# EasyEDA schematic 8Vregulator.json
TITLE: Sheet_1; REV: 1.0; Date: 2024-05-04; Sheet: 1/1; Drawn By: stevemuhilane; Company: Your Company
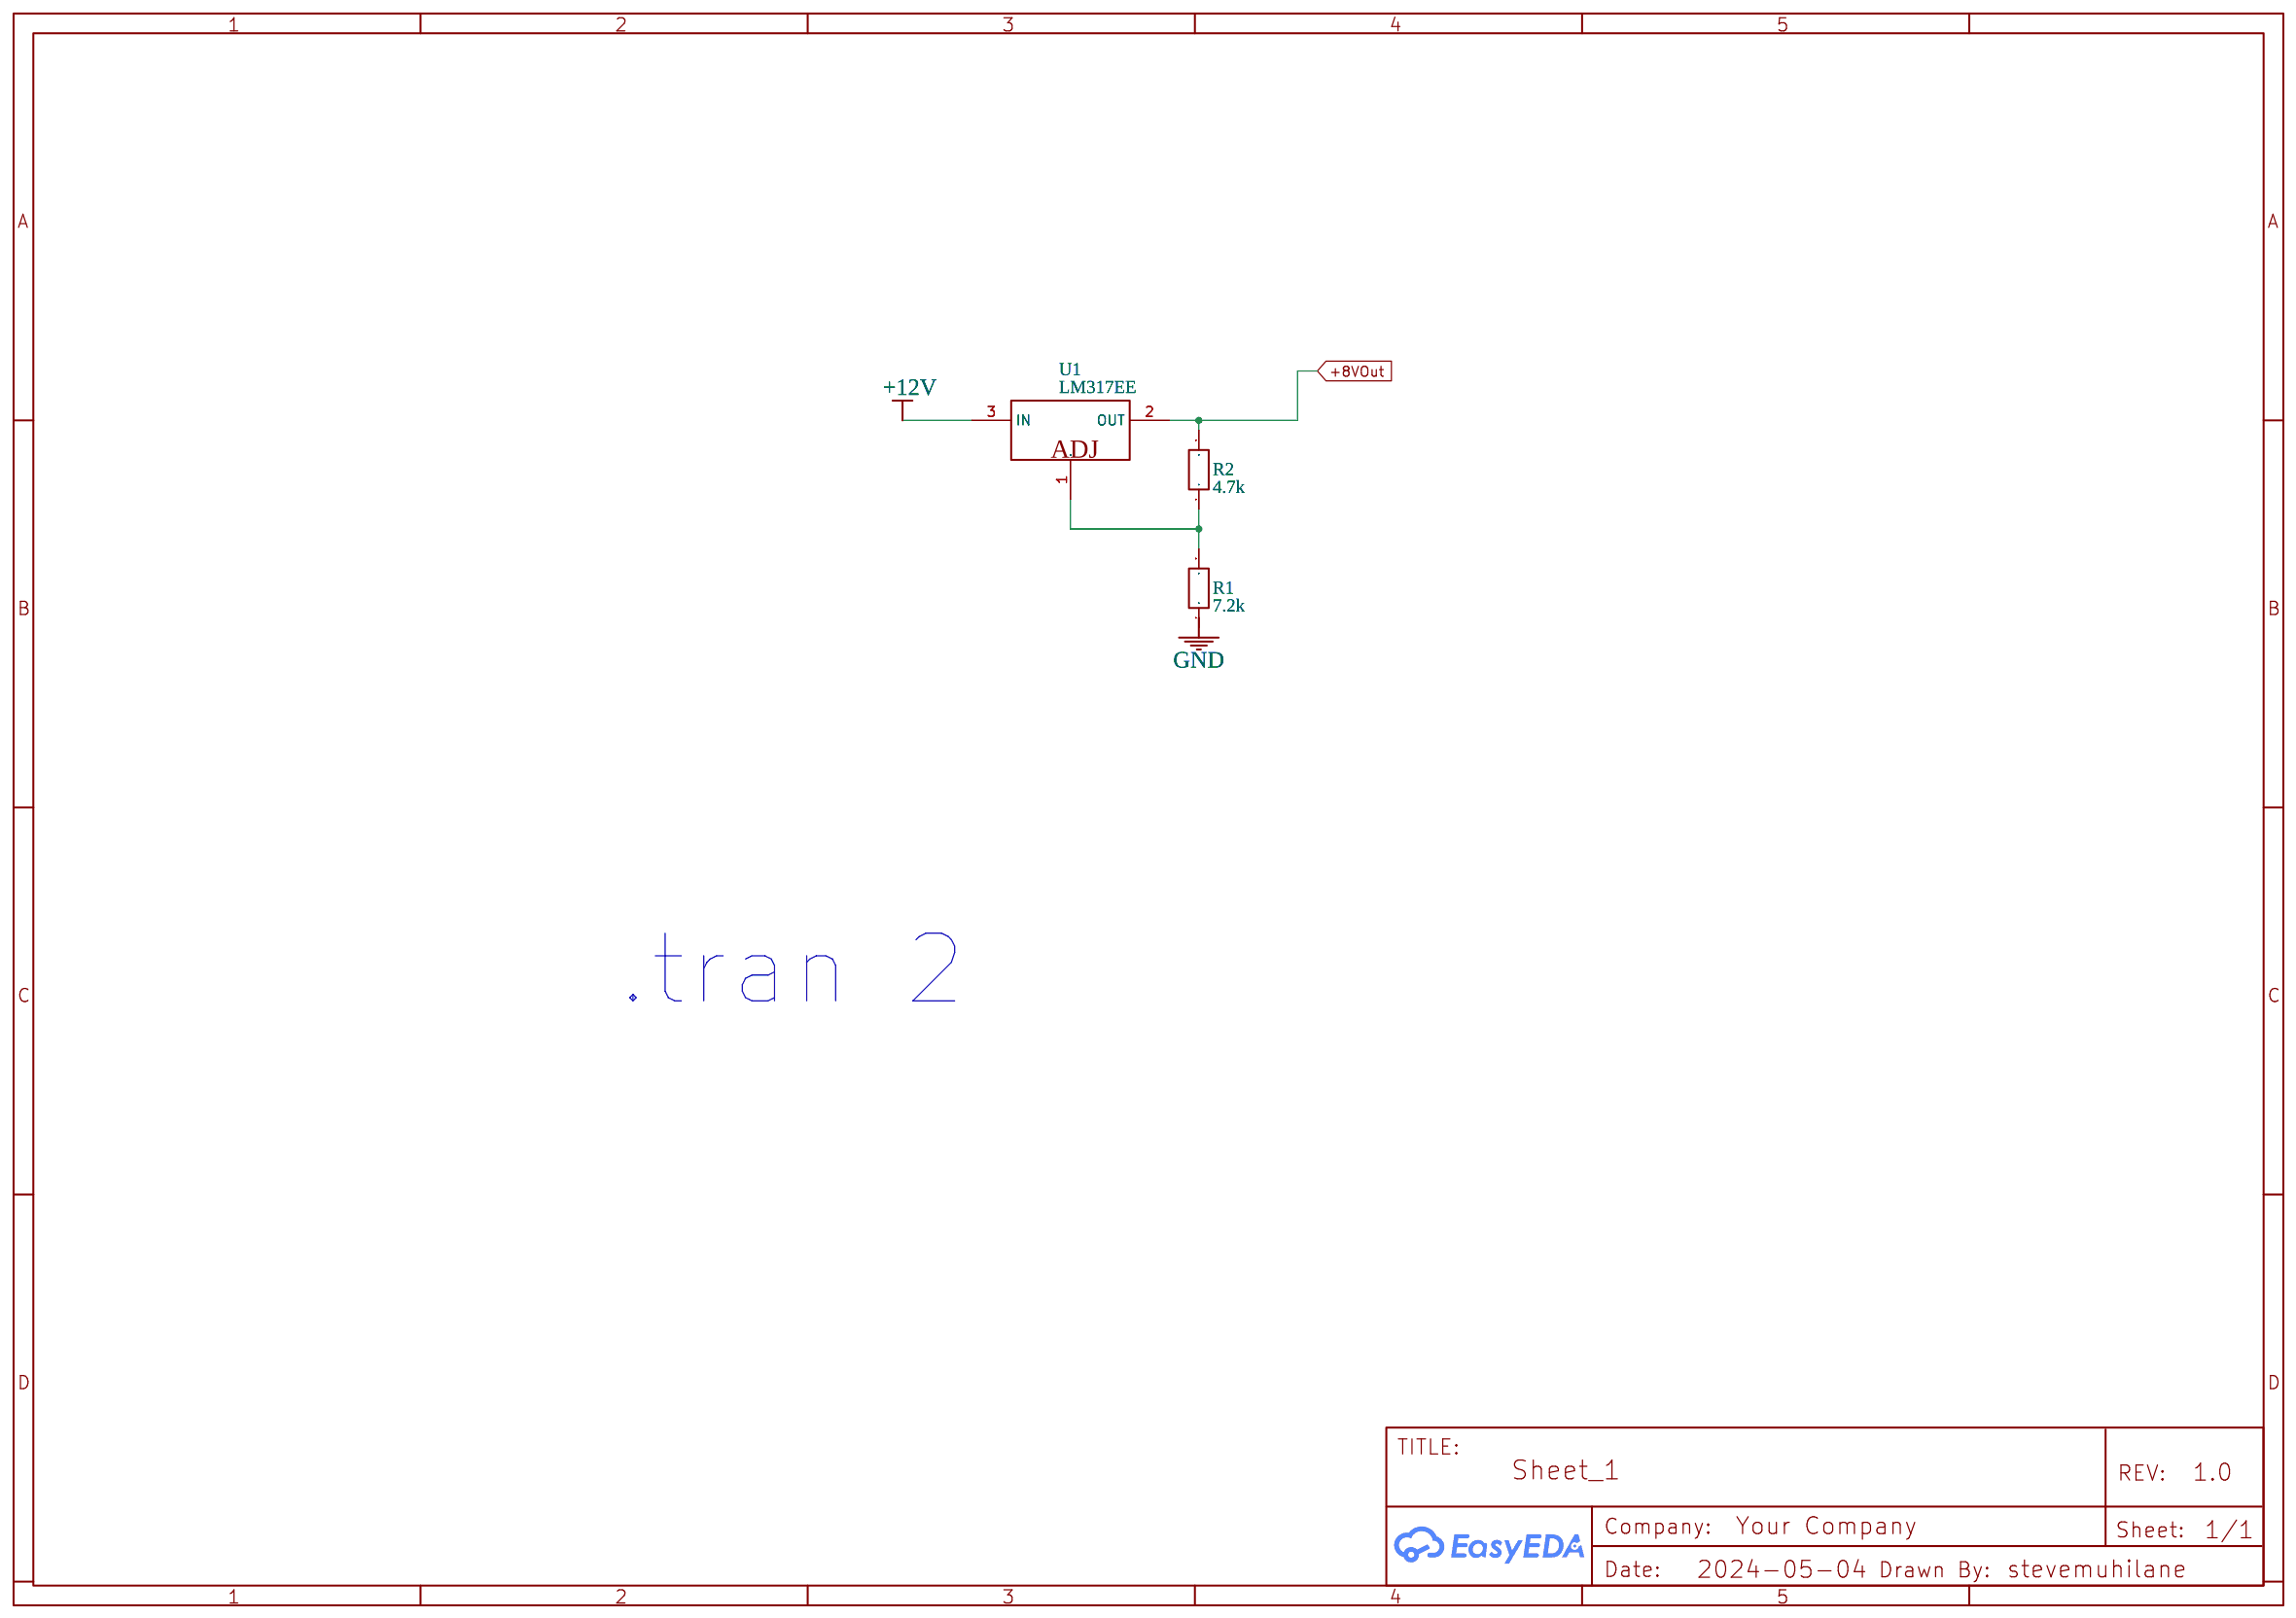
[diagram p0: schematic sheet]

## Parts
R1  7.2k  [AXIAL-0.3]
R2  4.7k  [AXIAL-0.3]
U1  LM317EE

## Library data of the parts
R1 R2 = Resistor_EU: Contributor: EasyEDA; Resistance: 1K
U1 = LM317: Contributor: EasyEDA

## Nets
+8VOut: R2.2 U1.2(OUT)
+12V: U1.3(IN)
Net-(R1-2): R1.2 R2.1 U1.1(ADJ)

Not connected (* = marked no-connect by the designer): R1 1

## Notes on the sheet
- .tran 2
